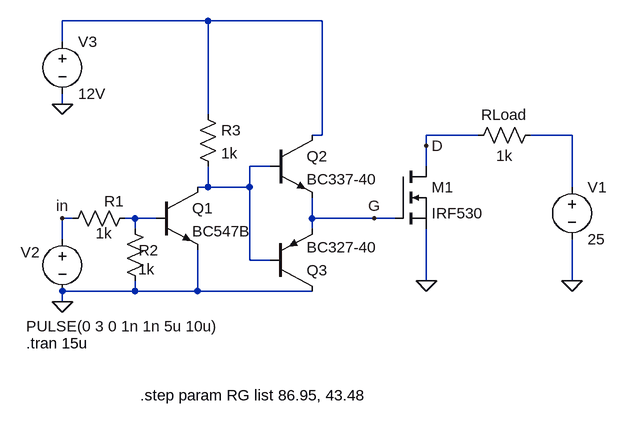
[diagram p0: schematic lab_06_LSSchalter_Pegelwandler_TotemPole_Loesung.asc]
lab_06_LSSchalter_Pegelwandler_TotemPole_Loesung.asc, the LTspice schematic file:
Version 4
SHEET 1 880 680
WIRE 0 -192 -224 -192
WIRE 176 -192 0 -192
WIRE -224 -160 -224 -192
WIRE -224 -64 -224 -80
WIRE 0 -48 0 -192
WIRE 176 -16 176 -192
WIRE 176 -16 160 -16
WIRE 416 -16 336 -16
WIRE 560 -16 496 -16
WIRE 336 0 336 -16
WIRE 96 32 64 32
WIRE 336 32 336 0
WIRE 0 64 0 32
WIRE 0 64 -16 64
WIRE 64 64 64 32
WIRE 64 64 0 64
WIRE 560 64 560 -16
WIRE -208 112 -224 112
WIRE -112 112 -128 112
WIRE -80 112 -112 112
WIRE 160 112 160 80
WIRE 256 112 160 112
WIRE 288 112 256 112
WIRE -112 128 -112 112
WIRE 160 128 160 112
WIRE -224 144 -224 112
WIRE 64 176 64 64
WIRE 96 176 64 176
WIRE 336 208 336 128
WIRE 560 208 560 144
WIRE -112 224 -112 208
WIRE -112 224 -224 224
WIRE -16 224 -16 160
WIRE -16 224 -112 224
WIRE 160 224 -16 224
WIRE -224 240 -224 224
FLAG 336 208 0
FLAG -224 240 0
FLAG 560 208 0
FLAG 256 112 G
FLAG 336 0 D
FLAG -224 112 in
FLAG -224 -64 0
SYMBOL nmos 288 32 R0
SYMATTR InstName M1
SYMATTR Value IRF530
SYMBOL voltage 560 48 R0
SYMATTR InstName V1
SYMATTR Value 25
SYMBOL voltage -224 128 R0
WINDOW 123 0 0 Left 0
WINDOW 39 0 0 Left 0
WINDOW 0 -64 36 Left 2
WINDOW 3 -56 150 Left 2
SYMATTR InstName V2
SYMATTR Value PULSE(0 3 0 1n 1n 5u 10u)
SYMBOL res 512 -32 R90
WINDOW 0 0 56 VBottom 2
WINDOW 3 32 56 VTop 2
SYMATTR InstName RLoad
SYMATTR Value 1k
SYMBOL npn -80 64 R0
SYMATTR InstName Q1
SYMATTR Value BC547B
SYMBOL res -112 96 R90
WINDOW 0 5 32 VBottom 2
WINDOW 3 23 48 VTop 2
SYMATTR InstName R1
SYMATTR Value 1k
SYMBOL res -96 224 R180
WINDOW 0 -20 63 Left 2
WINDOW 3 -14 34 Left 2
SYMATTR InstName R2
SYMATTR Value 1k
SYMBOL res -16 -64 R0
SYMATTR InstName R3
SYMATTR Value 1k
SYMBOL voltage -224 -176 R0
WINDOW 123 0 0 Left 0
WINDOW 39 0 0 Left 0
SYMATTR InstName V3
SYMATTR Value 12V
SYMBOL npn 96 -16 R0
SYMATTR InstName Q2
SYMATTR Value BC337-40
SYMBOL pnp 96 224 M180
SYMATTR InstName Q3
SYMATTR Value BC327-40
TEXT -280 304 Left 2 !.tran 15u
TEXT -104 384 Left 2 !.step param RG list 86.95, 43.48

The netlist it stands for:
* lab_06_LSSchalter_Pegelwandler_TotemPole_Loesung.asc
M1 D G 0 0 IRF530
V1 N002 0 25
V2 in 0 PULSE(0 3 0 1n 1n 5u 10u)
RLoad N002 D 1k
Q1 N003 N004 0 0 BC547B
R1 N004 in 1k
R2 0 N004 1k
R3 N001 N003 1k
V3 N001 0 12V
Q2 N001 N003 G 0 BC337-40
Q3 0 N003 G 0 BC327-40
.model NPN NPN
.model PNP PNP
.lib standard.bjt
.model NMOS NMOS
.model PMOS PMOS
.lib standard.mos
.tran 15u
.step param RG list 86.95, 43.48
.backanno
.end